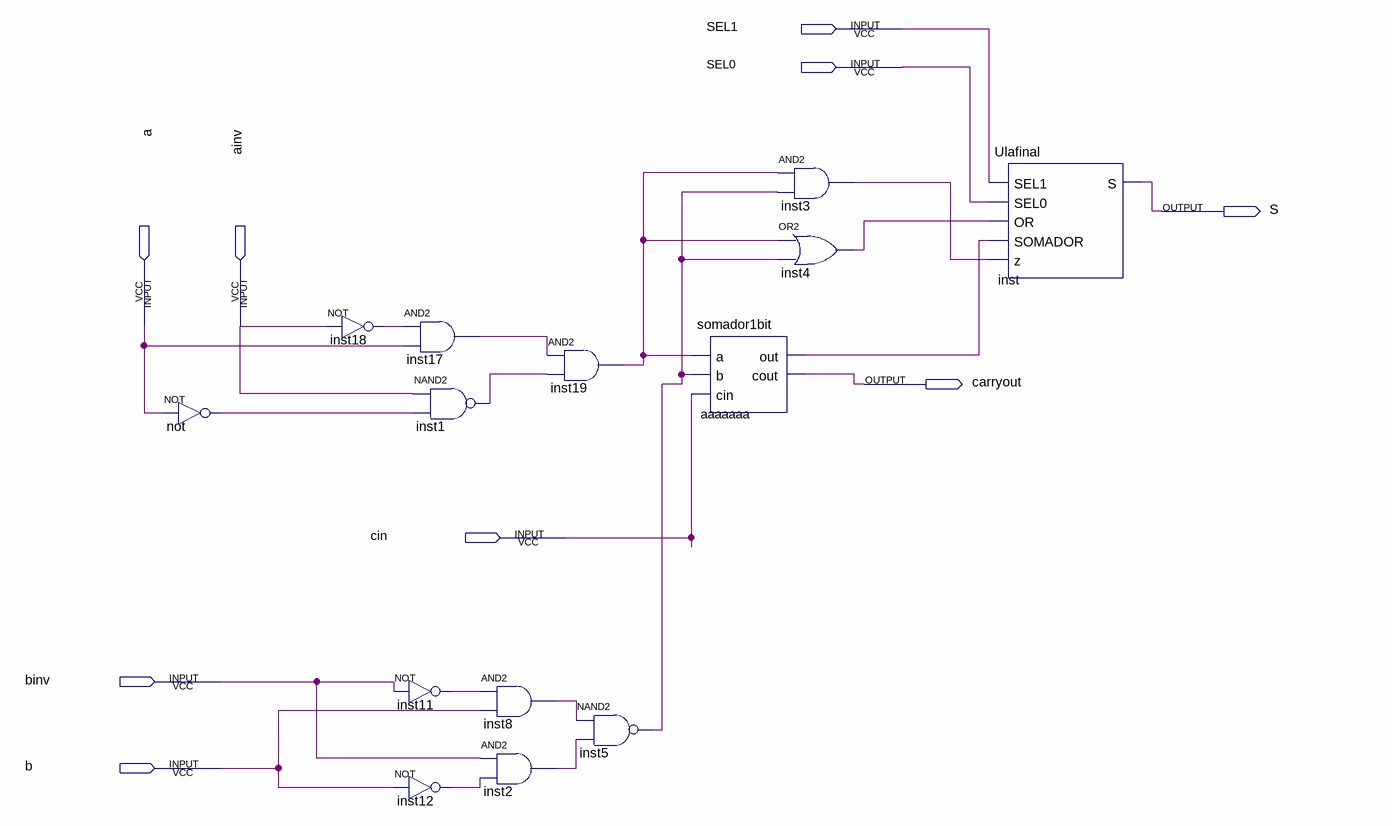
[diagram p0: schematic sheet]
// Quartus schematic finalprojectsoma.bdf as structural Verilog: 14 symbols, 9 pins
module finalprojectsoma (
  input  SEL1,
  input  SEL0,
  input  a,
  input  ainv,
  input  cin,
  input  binv,
  input  b,
  output S,
  output carryout
);

  wire aaaaaaa_out, inst1_out, inst2_out, inst3_out, inst4_out, inst5_out, inst8_out, inst11_out, inst12_out,
       inst17_out, inst18_out, inst19_out, not_out;

  not \not  (not_out, a);
  not inst18 (inst18_out, ainv);
  and inst17 (inst17_out, inst18_out, a);
  nand inst1 (inst1_out, ainv, not_out);
  not inst11 (inst11_out, binv);
  not inst12 (inst12_out, b);
  and inst8 (inst8_out, inst11_out, b);
  and inst2 (inst2_out, binv, inst12_out);
  and inst19 (inst19_out, inst17_out, inst1_out);
  nand inst5 (inst5_out, inst8_out, inst2_out);
  somador1bit aaaaaaa (.a(inst19_out), .b(inst5_out), .cin(cin), .out(aaaaaaa_out), .cout(carryout));
  and inst3 (inst3_out, inst19_out, inst5_out);
  or inst4 (inst4_out, inst19_out, inst5_out);
  Ulafinal inst (.SEL1(SEL1), .SEL0(SEL0), .OR(inst4_out), .SOMADOR(aaaaaaa_out), .z(inst3_out), .S(S));
endmodule
